# Altium schematic sheet Sheet1.SchDoc
size A
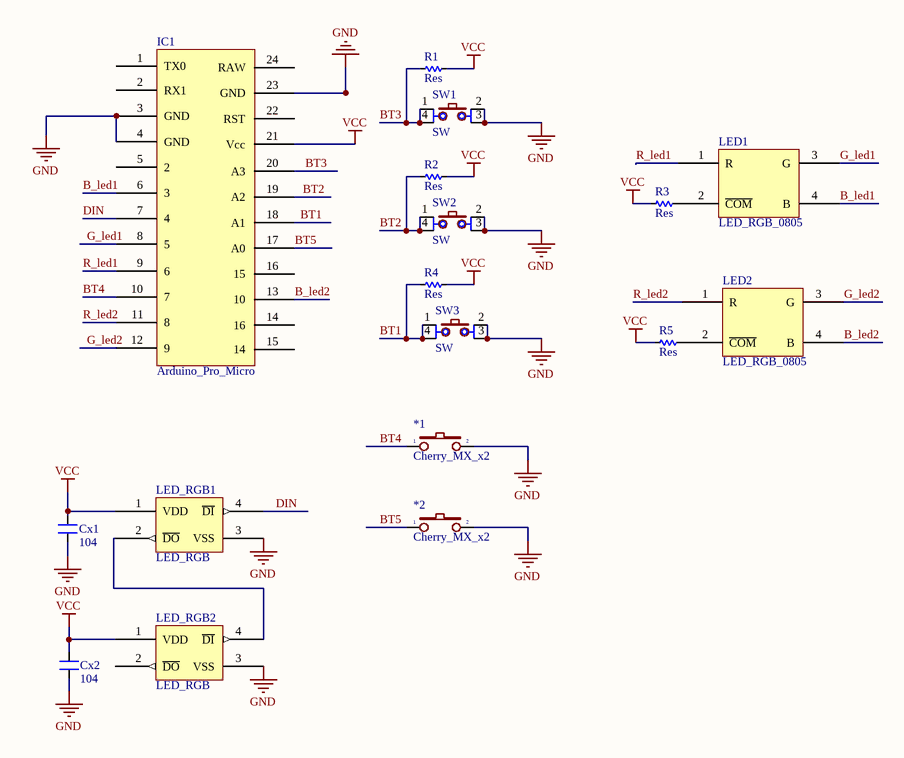
[diagram p0: Sheet1.SchDoc]

## Parts
*1  Cherry_MX_x2  [Cherry_Mx_2]
*2  Cherry_MX_x2  [Cherry_Mx_2]
Cx1  104  [CN-SMD-0805]
Cx2  104  [CN-SMD-0805]
IC1  Arduino_Pro_Micro  [PCBComponent_1]
LED1  LED_RGB_0805  [PCBComponent_1]
LED2  LED_RGB_0805  [PCBComponent_1]
LED_RGB1  LED_RGB  [PCBComponent_1]
LED_RGB2  LED_RGB  [PCBComponent_1]
R1  Res  [RES-SMD-0805]
R2  Res  [RES-SMD-0805]
R3  Res  [RES-SMD-0805]
R4  Res  [RES-SMD-0805]
R5  Res  [RES-SMD-0805]
SW1  SW  [SW2-DIP]
SW2  SW  [SW2-DIP]
SW3  SW  [SW2-DIP]

## Nets
GND: *1.2 *2.2 Cx1.2 Cx2.2 IC1.3(GND) IC1.4(GND) IC1.23(GND) LED_RGB1.3(VSS) LED_RGB2.3(VSS) SW1.2 SW1.3 SW2.2 SW2.3 SW3.2 SW3.3
VCC: Cx1.1 Cx2.1 IC1.21(Vcc) LED_RGB1.1(VDD) LED_RGB2.1(VDD) R1.1 R2.1 R3.2 R4.1 R5.2
B_led1: IC1.6(3) LED1.4(B)
B_led2: IC1.13(10) LED2.4(B)
BT1: IC1.18(A1) R4.2 SW3.1 SW3.4
BT2: IC1.19(A2) R2.2 SW2.1 SW2.4
BT3: IC1.20(A3) R1.2 SW1.1 SW1.4
BT4: *1.1 IC1.10(7)
BT5: *2.1 IC1.17(A0)
DIN: IC1.7(4) LED_RGB1.4(~{DI})
G_led1: IC1.8(5) LED1.3(G)
G_led2: IC1.12(9) LED2.3(G)
R_led1: IC1.9(6) LED1.1(R)
R_led2: IC1.11(8) LED2.1(R)
NetLED1_2: LED1.2(~{COM}) R3.1
NetLED2_2: LED2.2(~{COM}) R5.1
NetLED_RGB1_2: LED_RGB1.2(~{DO}) LED_RGB2.4(~{DI})

Not connected (* = marked no-connect by the designer): IC1 1(TX0) 2(RX1) 5(2) 14(16) 15(14) 16(15) 22(RST) 24(RAW); LED_RGB2 2(~{DO})

## Library data of the parts
Cx1 Cx2 = CN: Value: 33pF
LED_RGB1 LED_RGB2 = LED_RGB_5050_WS2812B: LED?
R1-R5 = Res-SMD: Resistor; Manufacturer: Generic Components; Class: Passive; Published: 08/06/2000; Publisher: Altium Hobart Technology Centre
SW1-SW3 = SW4: Switch button 4 pin; Value: Button chip 4 pin